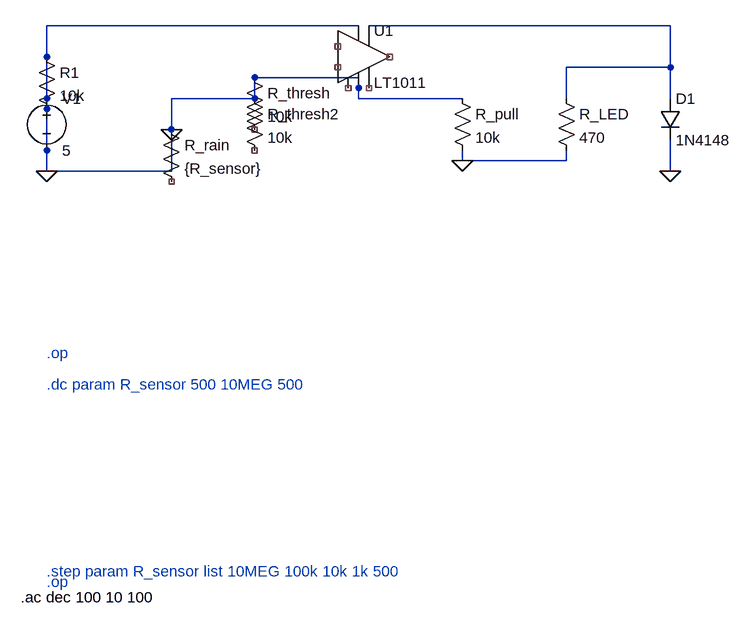
[diagram p0: schematic rain_detector.asc]
rain_detector.asc, the LTspice schematic file:
Version 4.1
SHEET 1 1680 1080
WIRE 640 48 160 48
WIRE 1120 48 656 48
WIRE 160 96 160 48
WIRE 1120 112 1120 48
WIRE 1120 112 960 112
WIRE 640 128 480 128
WIRE 640 144 640 128
WIRE 160 160 160 96
WIRE 480 160 480 128
WIRE 480 160 352 160
WIRE 640 160 640 144
WIRE 800 160 640 160
WIRE 960 160 960 112
WIRE 1120 160 1120 112
WIRE 160 176 160 160
WIRE 352 208 352 160
WIRE 160 240 160 176
WIRE 800 256 800 240
WIRE 960 256 960 240
WIRE 960 256 800 256
WIRE 160 272 160 240
WIRE 352 272 352 208
WIRE 352 272 160 272
WIRE 1120 272 1120 224
FLAG 160 272 0
FLAG 352 208 0
FLAG 800 256 0
FLAG 1120 272 0
SYMBOL voltage 160 144 R0
SYMATTR InstName V1
SYMATTR Value 5
SYMATTR SpiceModel PULSE(0 5 0 1n 1n 1 2)
SYMBOL res 144 80 R0
SYMATTR InstName R1
SYMATTR Value 10k
SYMBOL res 336 192 R0
SYMATTR InstName R_rain
SYMATTR Value {R_sensor}
SYMBOL res 464 112 R0
SYMATTR InstName R_thresh
SYMATTR Value 10k
SYMBOL res 464 144 R0
SYMATTR InstName R_thresh2
SYMATTR Value 10k
SYMBOL Comparators\\LT1011 640 96 R0
SYMATTR InstName U1
SYMBOL res 784 144 R0
SYMATTR InstName R_pull
SYMATTR Value 10k
SYMBOL res 944 144 R0
SYMATTR InstName R_LED
SYMATTR Value 470
SYMBOL diode 1104 160 R0
SYMATTR InstName D1
SYMATTR Value 1N4148
TEXT 160 552 Left 2 ;.op
TEXT 160 600 Left 2 ;.dc param R_sensor 500 10MEG 500
TEXT 160 888 Left 2 ;.step param R_sensor list 10MEG 100k 10k 1k 500
TEXT 160 904 Left 2 ;.op
TEXT 120 928 Left 2 !.ac dec 100 10 100

The netlist it stands for:
* rain_detector.asc
V1 0 0 PULSE(0 5 0 1n 1n 1 2) 5
R1 0 0 10k
R_rain 0 NC_01 {R_sensor}
R_thresh 0 NC_02 10k
R_thresh2 0 NC_03 10k
X§U1 NC_04 NC_05 NC_06 0 N001 NC_07 NC_08 0 LT1011
R_pull 0 0 10k
R_LED N001 0 470
D1 N001 0 1N4148
.model D D
.lib standard.dio
* .op
* .dc param R_sensor 500 10MEG 500
* .step param R_sensor list 10MEG 100k 10k 1k 500
* .op
.ac dec 100 10 100
.lib LTC1.lib
.backanno
.end